# EAGLE design DPbadge (EAGLE 5.07)
LICENSE: CC-0
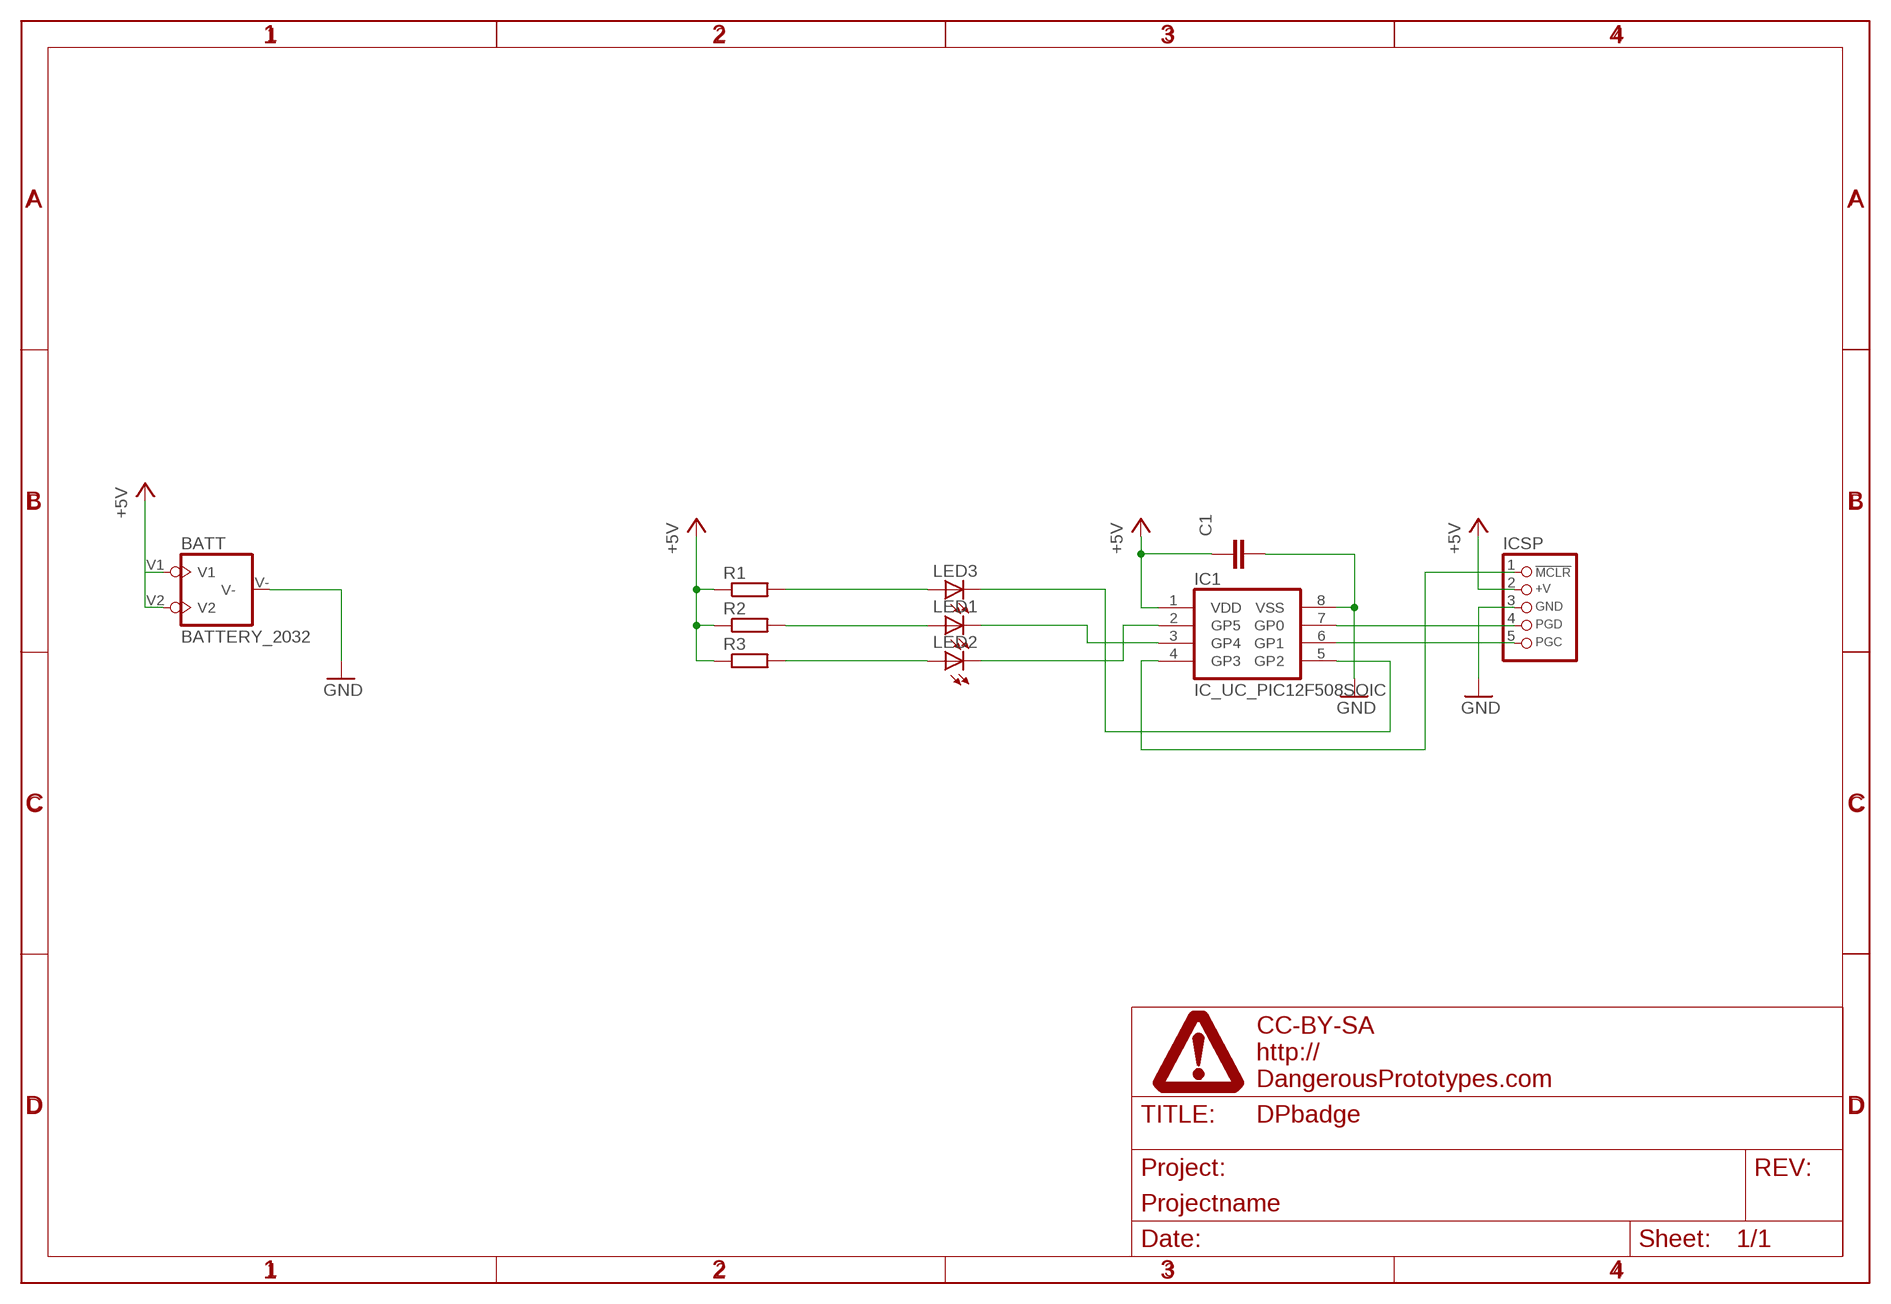
[diagram p0: schematic, sheet 1]

## Parts
BATT  BATTERY_2032  [BATT2032]
C1  CAPACITOR_NPOL-0603  [C603]
IC1  IC_UC_PIC12F508SOIC  [SO-8]
ICSP  CON_HEADER_PRG_PIC_ICSPB  [HEADER_PRG_1X05_ICSP_B]
LED1  LED-3MM  [LED-3MM]
LED2  LED-3MM  [LED-3MM]
LED3  LED-3MM  [LED-3MM]
R1  RESISTOR-0603  [R603]
R2  RESISTOR-0603  [R603]
R3  RESISTOR-0603  [R603]
U$1  FRAME_DINA4_L  [DP_LOGO]

## Nets
+5V: BATT.V1 BATT.V2 C1.1 IC1.1(VDD) ICSP.2(+V) R1.1 R2.1 R3.1
GND: BATT.V- C1.2 IC1.8(VSS) ICSP.3(GND)
N$1: IC1.5(GP2) LED3.K(C)
N$2: LED3.A R1.2
N$3: IC1.2(GP5) LED2.K(C)
N$4: LED2.A R3.2
N$5: IC1.6(GP1) ICSP.5(PGC)
N$7: IC1.3(GP4) LED1.K(C)
N$8: IC1.7(GP0) ICSP.4(PGD)
N$9: IC1.4(GP3) ICSP.1(/MCLR)
N$10: LED1.A R2.2

## Library data of the parts
BATT = dp_devices:BATTERY_2032: BATTERY
C1 = dp_devices:CAPACITOR_NPOL: Non-Polarized capacitor in various packages
IC1 = dp_devices:IC_UC_PIC12F508
ICSP = dp_devices:CON_HEADER_PRG_PIC_ICSP: 5-pin PIC In Circuit Serial Programming header
LED1-LED3 = dp_devices:LED: Light Emitting Diode
R1-R3 = dp_devices:RESISTOR
U$1 = dp_devices:FRAME_DINA4_L: A4 DP frame Standard Dangerous Prototypes schematic frame. Automagically adds the DP logo and standard texts to the PCB Use the atrribute in the schematic editor to change the fields.; FF1: fulfillment by; FF2: Seeed Studio; FF3: www.seeedstudio.com; LICENSE: CC-BY-SA; PROJECT: Projectname; URL1: http://; URL2: DangerousPrototypes.com

## Board
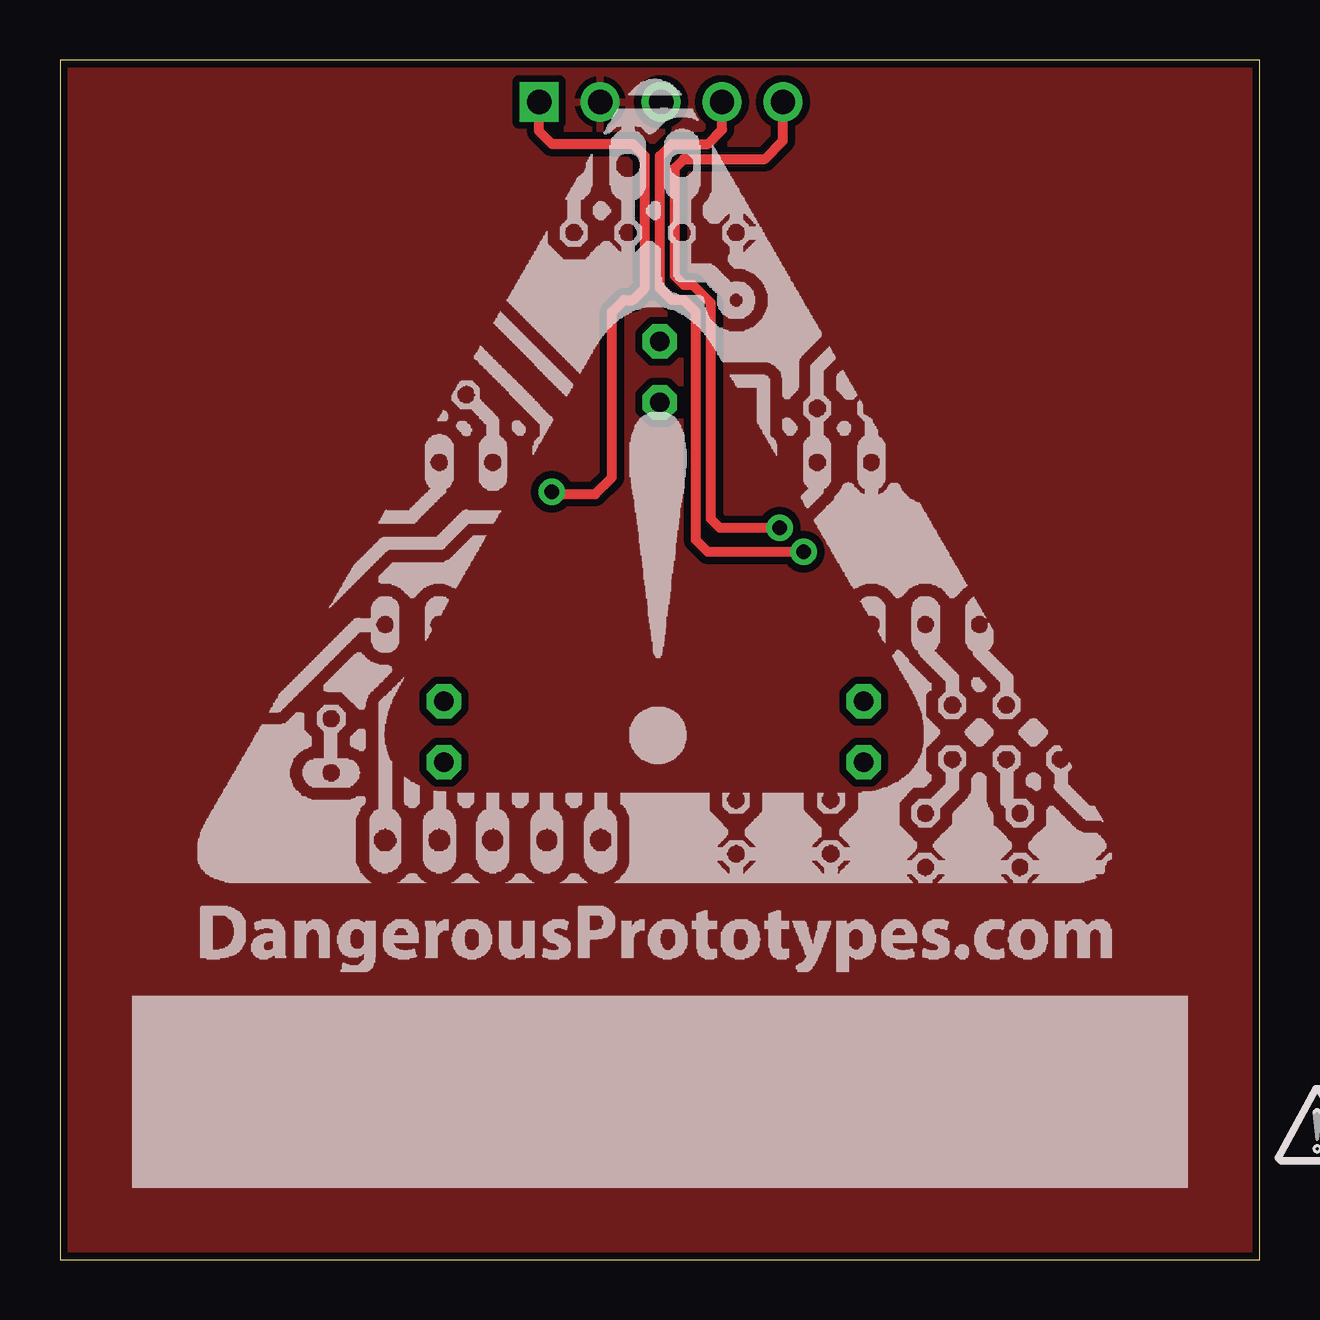
[diagram p1: board, top side]
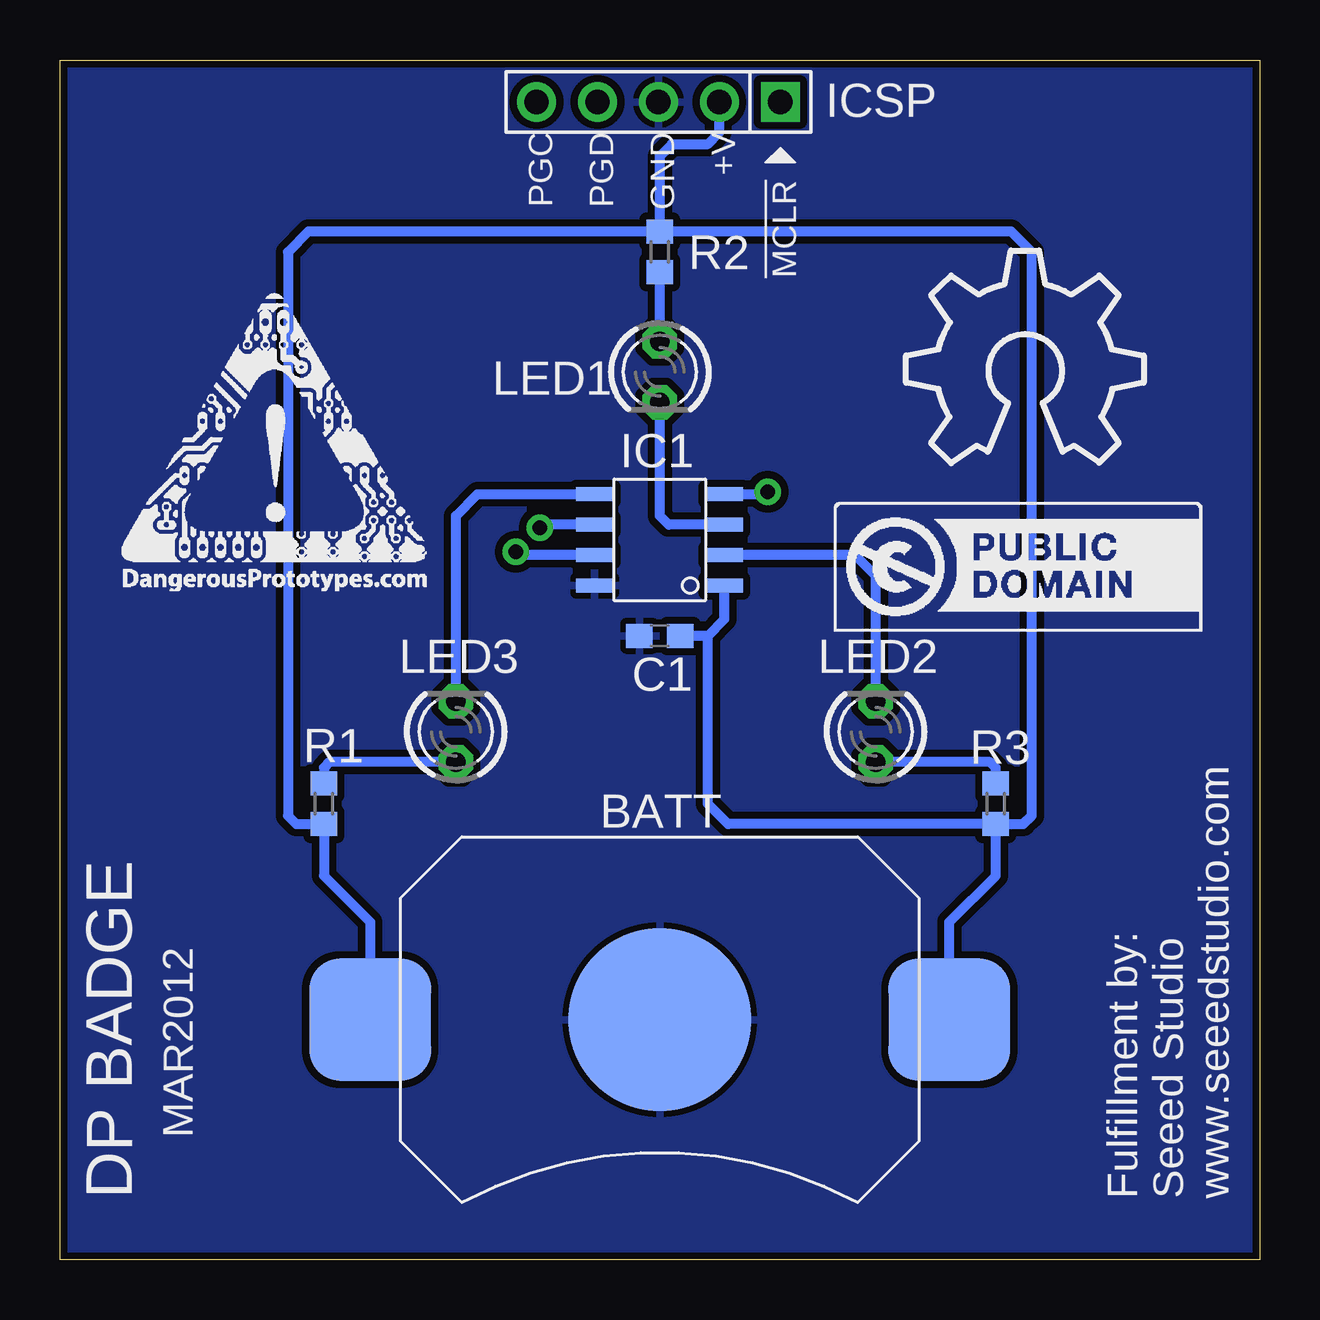
[diagram p2: board, bottom side, seen from below]

Size 50 x 50 mm. Coordinates in mm from the lower left corner, seen from the top.
Outline: 0,0 50,0 50,50 0,50 0,0
Copper layers (1*16): Top 0.035mm / dielectric 1.5mm / Bottom 0.035mm
Design rules "SparkFun": minimum track width 8mil, minimum drill 20mil, track to track 8mil, track to pad 8mil, pad to pad 8mil, via to via 8mil, smd to smd 8mil, copper to edge 10mil, drill to drill 8mil, minimum pad ring 12mil, minimum via ring 10mil, stop-mask expansion 4mil, vias tented up to drill 25mil, thermal gap 10mil

### Footprints (pad centres in the part's own frame; a part is rotated, then mirrored left to right if it is on the bottom)
BATT2032 = smd 5.08 x 5.08: V1 -12.065,0; V2 12.065,0 | smd 7.62 x 7.62: V- 0,0
C603 = smd 1.1 x 1: 1 -0.85,0; 2 0.85,0
SO-8 = smd 0.6 x 1.55: 1 -1.905,-2.69; 2 -0.635,-2.69; 3 0.635,-2.69; 4 1.905,-2.69; 5 1.905,2.71; 6 0.635,2.71; 7 -0.635,2.71; 8 -1.905,2.71
HEADER_PRG_1X05_ICSP_B = drill 1.016 square: 1 -5.08,0 | drill 1.016 round: 2 -2.54,0; 3 0,0; 4 2.54,0; 5 5.08,0
LED-3MM = drill 0.813 octagon: A -1.27,0; K 1.27,0
R603 = smd 1 x 1.1: 1 -0.85,0; 2 0.85,0

### Placement (x,y rotation side)
BATT  25,10 0 bottom
C1  25,26 180 bottom
IC1  25,30 90 bottom
ICSP  25.05,48.25 180 bottom
LED1  25,37 270 bottom
LED2  16,22 90 bottom
LED3  33.5,22 90 bottom
R1  39,19 90 bottom
R2  25,42 270 bottom
R3  11,19 90 bottom
U$1  52.4,4.62 0 top
U$2  [DP_LOGO_ART_1.5X1.5]  5.75,12 0 top
U$3  [LOGO_CC-0]  17.73,26.19 0 bottom
U$4  [DP_LOGO_ART_0.5X0.5]  47.41,27.87 0 bottom
U$5  [OSHW_10X350_NOTEXT]  14.73,33.19 0 bottom

### Tracks (layer width: path | path; a pad name or v marks a point on that pad's centre or on a via)
+5V
  Bottom 0.406: 23,26 C1.1 | IC1.1 22.31,26.69 23,26 | R3.1 11,16 12.94,14.06 BATT.V2 | BATT.V1 37.06,14.06 39,16 R1.1 40.15,18.15 40.5,18.5 40.5,42 39.65,42.85 R2.1 | R3.1 9.85,18.15 9.5,18.5 9.5,42 10.35,42.85 R2.1 | R3.1 22.15,18.15 23,19 23,26 | R2.1 25,46 24.5,46.5 23,46.5 22.52,46.98 ICSP.2
  pour Top (isolate 0.305): 0,50 0,0 50,0 50,50
GND
  pour Bottom (isolate 0.305): 0,50 0,0 50,0 50,50
N$1
  Bottom 0.406: LED3.K 33.5,31 32.59,31.91 IC1.5
N$2
  Bottom 0.406: LED3.A 38.77,20.73 39,20.5 R1.2
N$3
  Bottom 0.406: LED2.K 16,28.5 16.86,29.36 IC1.2
N$4
  Bottom 0.406: LED2.A 11.23,20.73 11,20.5 R3.2
N$5  (via drill 0.6)
  Top 0.406: ICSP.5 30.14,46.63 29.38,45.88 26,45.88 25.62,45.5 25.62,41 26,40.62 26.38,40.62 27.12,39.88 27.12,30.88 27.5,30.5 v30,30.5
  Bottom 0.406: IC1.6 29.86,30.64 v30,30.5
N$7
  Bottom 0.406: IC1.3 24.64,30.64 25,31 LED1.K
N$8  (via drill 0.6)
  Top 0.406: ICSP.4 27.59,47.09 27,46.5 25.5,46.5 25,46 25,40.5 25.5,40 26,40 26.5,39.5 26.5,30 27,29.5 v31,29.5
  Bottom 0.406: IC1.7 30.86,29.36 v31,29.5
N$9  (via drill 0.6)
  Top 0.406: ICSP.1 19.98,47.02 20.5,46.5 23.88,46.5 24.38,46 24.38,40.5 23.88,40 23.5,40 23,39.5 23,32.59 IC1.4 20.59,31.91 v20.5,32
  Bottom 0.406: IC1.4 20.59,31.91 v20.5,32
N$10
  Bottom 0.406: LED1.A R2.2

### Text on the board
bNames: +V | GND | PGD | PGC | !MCLR | MAR2012 | www.seeedstudio.com | Seeed Studio | Fulfillment by: | DP BADGE